# EAGLE schematic NoiseSampleHold (EAGLE 9.6.2)
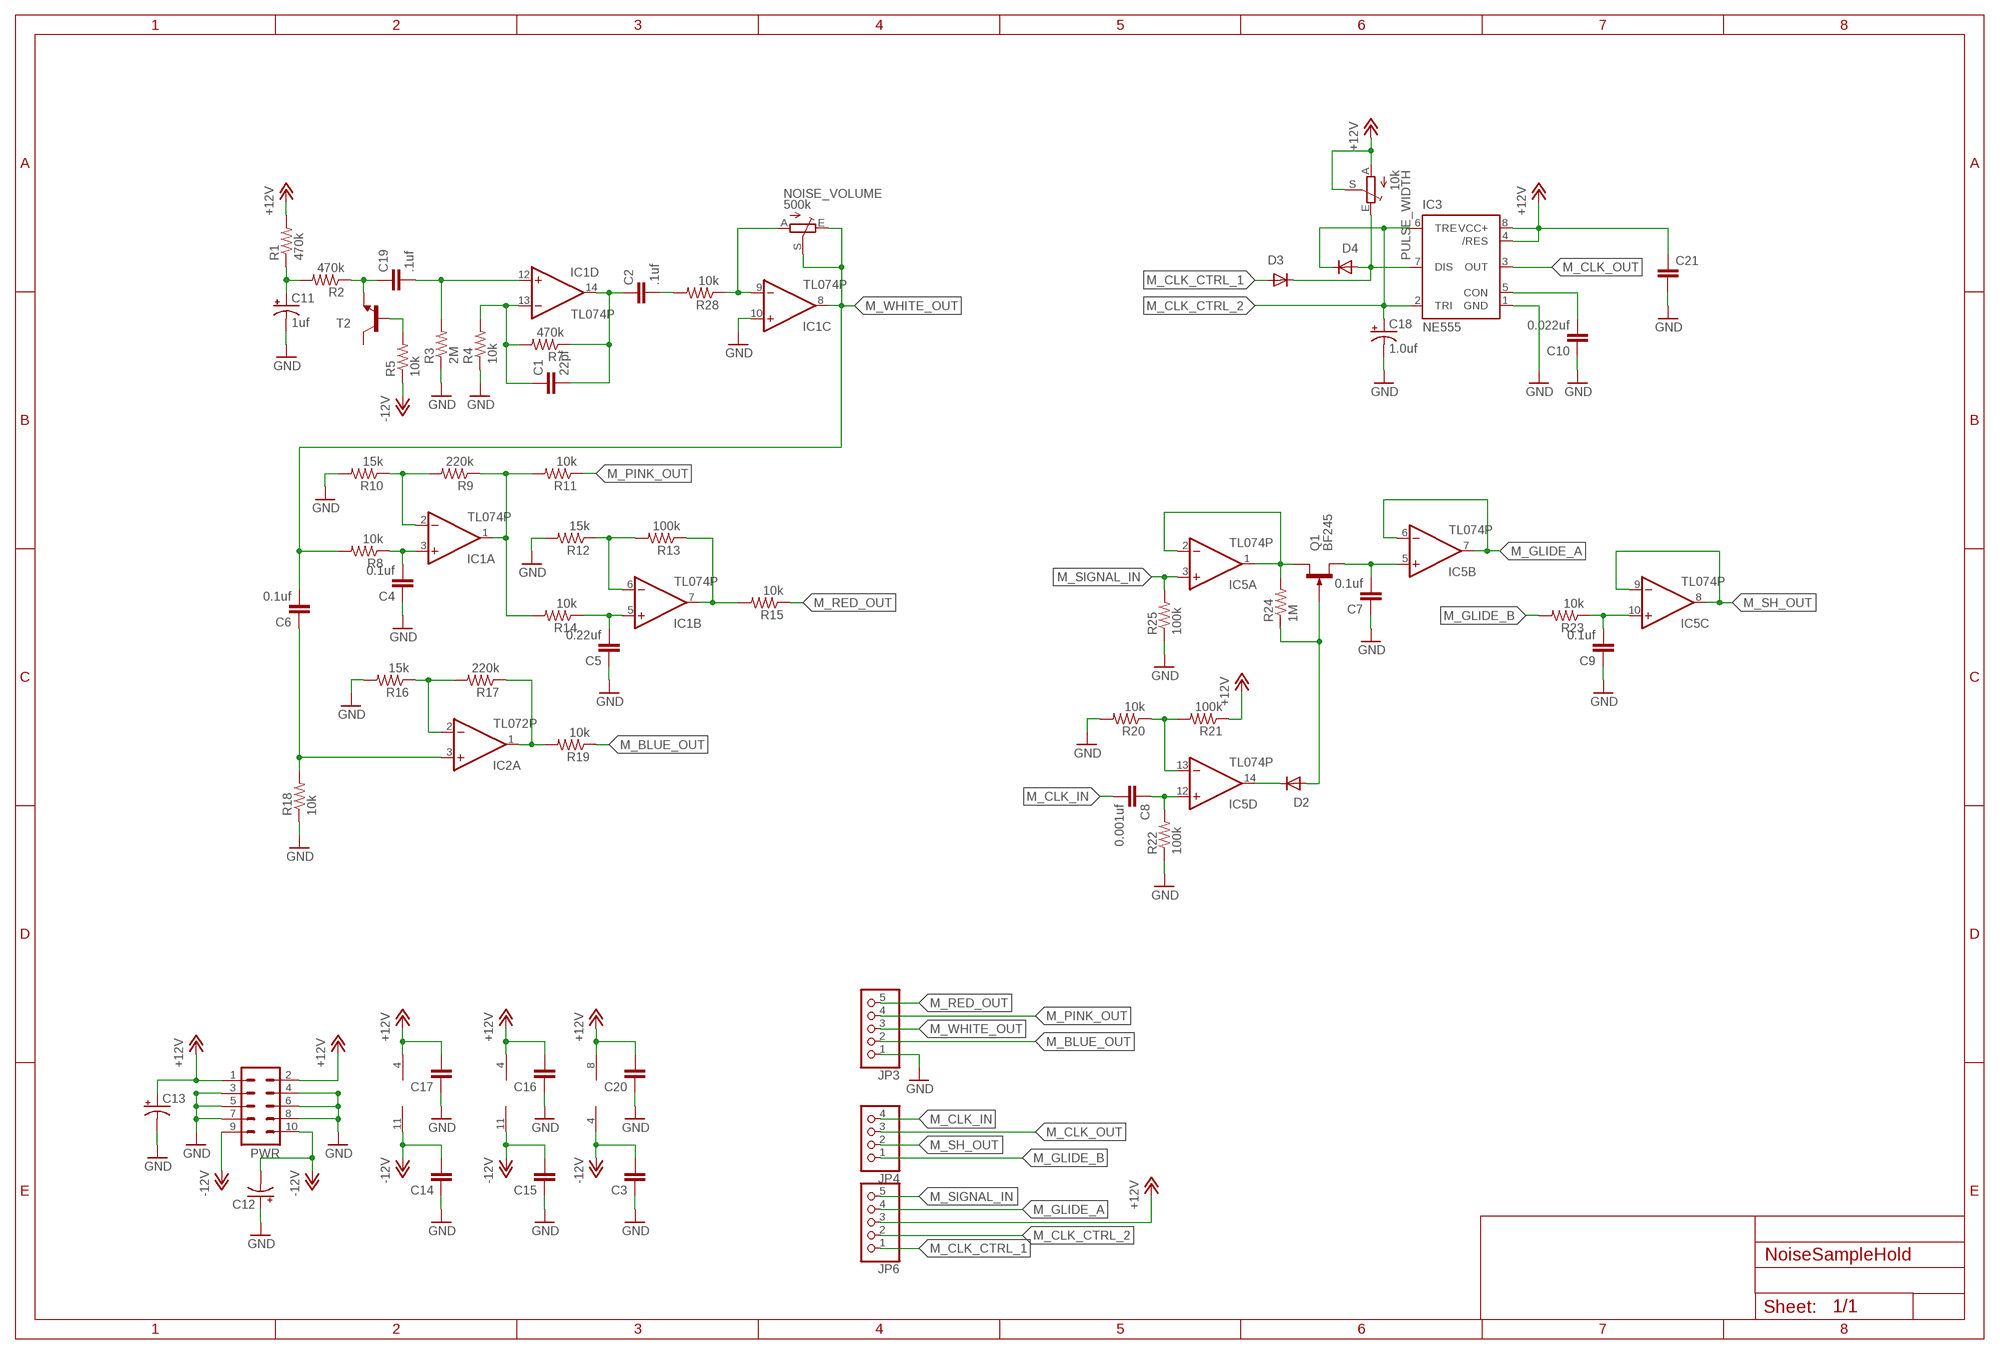
[diagram p0: schematic, sheet 1]

## Parts
C1  22pf  C-EU050-024X044  [C050-024X044]
C2  .1uf  C-EU050-024X044  [C050-024X044]
C3  C-EU050-024X044  [C050-024X044]
C4  0.1uf  C-EU050-024X044  [C050-024X044]
C5  0.22uf  C-EU050-024X044  [C050-024X044]
C6  0.1uf  C-EU050-024X044  [C050-024X044]
C7  0.1uf  C-EU050-024X044  [C050-024X044]
C8  0.001uf  C-EU050-024X044  [C050-024X044]
C9  0.1uf  C-EU050-024X044  [C050-024X044]
C10  0.022uf  C-EU050-024X044  [C050-024X044]
C11  1uf  CPOL-USE2.5-5  [E2,5-5]
C12  CPOL-USE2.5-5  [E2,5-5]
C13  CPOL-USE2.5-5  [E2,5-5]
C14  C-EU050-024X044  [C050-024X044]
C15  C-EU050-024X044  [C050-024X044]
C16  C-EU050-024X044  [C050-024X044]
C17  C-EU050-024X044  [C050-024X044]
C18  1.0uf  CPOL-USE2.5-5  [E2,5-5]
C19  .1uf  C-EU050-024X044  [C050-024X044]
C20  C-EU050-024X044  [C050-024X044]
C21  C-EU050-024X044  [C050-024X044]
D2  1N4148DO35-7  [DO35-7]
D3  1N4148DO35-7  [DO35-7]
D4  1N4148DO35-7  [DO35-7]
IC1  TL074P  [DIL14]
IC2  TL072P  [DIL08]
IC3  NE555  [DIL-08]
IC5  TL074P  [DIL14]
JP3  PINHD-1X5  [1X05]
JP4  PINHD-1X4  [1X04]
JP6  PINHD-1X5  [1X05]
NOISE_VOLUME  500k  TRIM_1234-S64YW  [S64YW]
PULSE_WIDTH  10k  TRIM_1234-S64YW  [S64YW]
PWR  ML10  [ML10]
Q1  BF245  [SOT54C]
R1  470k  R-US_0204/7  [0204/7]
R2  470k  R-US_0204/7  [0204/7]
R3  2M  R-US_0204/7  [0204/7]
R4  10k  R-US_0204/7  [0204/7]
R5  10k  R-US_0204/7  [0204/7]
R7  470k  R-US_0204/7  [0204/7]
R8  10k  R-US_0204/7  [0204/7]
R9  220k  R-US_0204/7  [0204/7]
R10  15k  R-US_0204/7  [0204/7]
R11  10k  R-US_0204/7  [0204/7]
R12  15k  R-US_0204/7  [0204/7]
R13  100k  R-US_0204/7  [0204/7]
R14  10k  R-US_0204/7  [0204/7]
R15  10k  R-US_0204/7  [0204/7]
R16  15k  R-US_0204/7  [0204/7]
R17  220k  R-US_0204/7  [0204/7]
R18  10k  R-US_0204/7  [0204/7]
R19  10k  R-US_0204/7  [0204/7]
R20  10k  R-US_0204/7  [0204/7]
R21  100k  R-US_0204/7  [0204/7]
R22  100k  R-US_0204/7  [0204/7]
R23  10k  R-US_0204/7  [0204/7]
R24  1M  R-US_0204/7  [0204/7]
R25  100k  R-US_0204/7  [0204/7]
R28  10k  R-US_0204/7  [0204/7]
T2  2N3904-NPN-TO92-EBC  [TO92-EBC]

## Nets
+12V: C13.+ C16.2 C17.2 C20.2 C21.1 IC1.4(P:V+) IC2.8(P:V+) IC3.4(/RES) IC3.8(VCC+) IC5.4(P:V+) JP6.3 PULSE_WIDTH.A PULSE_WIDTH.S PWR.1 PWR.2 R1.2 R21.1
-12V: C3.2 C12.- C14.2 C15.2 IC1.11(P:V-) IC2.4(P:V-) IC5.11(P:V-) PWR.9 PWR.10 R5.1
GND: C3.1 C4.1 C5.1 C7.1 C9.1 C10.1 C11.- C12.+ C13.- C14.1 C15.1 C16.1 C17.1 C18.- C20.1 C21.2 IC1.10(C:+IN) IC3.1(GND) JP3.1 PWR.3 PWR.4 PWR.5 PWR.6 PWR.7 PWR.8 R3.1 R4.1 R10.2 R12.2 R16.2 R18.1 R20.2 R22.1 R25.1
M_BLUE_OUT: JP3.2 R19.1
M_CLK_CTRL_1: D3.A JP6.1
M_CLK_CTRL_2: C18.+ D4.C IC3.2(TRI) IC3.6(TRE) JP6.2
M_CLK_IN: C8.2 JP4.4
M_CLK_OUT: IC3.3(OUT) JP4.3
M_GLIDE_A: IC5.6(B:-IN) IC5.7(B:OUT) JP6.4
M_GLIDE_B: JP4.1 R23.2
M_PINK_OUT: JP3.4 R11.1
M_RED_OUT: JP3.5 R15.1
M_SH_OUT: IC5.8(C:OUT) IC5.9(C:-IN) JP4.2
M_SIGNAL_IN: IC5.3(A:+IN) JP6.5 R25.2
M_WHITE_OUT: C6.2 IC1.8(C:OUT) JP3.3 NOISE_VOLUME.E NOISE_VOLUME.S R8.2
N$1: C19.1 R2.1 T2.E
N$2: C11.+ R1.1 R2.2
N$3: R5.2 T2.B
N$4: C19.2 IC1.12(D:+IN) R3.2
N$5: C1.1 IC1.13(D:-IN) R4.2 R7.2
N$6: C1.2 C2.1 IC1.14(D:OUT) R7.1
N$7: C2.2 R28.2
N$10: C4.2 IC1.3(A:+IN) R8.1
N$11: IC1.2(A:-IN) R9.2 R10.1
N$12: IC1.1(A:OUT) R9.1 R11.2 R14.2
N$13: IC5.1(A:OUT) IC5.2(A:-IN) Q1.D R24.2
N$16: IC1.6(B:-IN) R12.1 R13.2
N$17: IC1.7(B:OUT) R13.1 R15.2
N$18: C5.2 IC1.5(B:+IN) R14.1
N$19: D3.C D4.A IC3.7(DIS) PULSE_WIDTH.E
N$20: C6.1 IC2.3(A:+IN) R18.2
N$21: IC2.2(A:-IN) R16.1 R17.2
N$22: IC2.1(A:OUT) R17.1 R19.2
N$23: C10.2 IC3.5(CON)
N$24: IC5.13(D:-IN) R20.1 R21.2
N$25: C8.1 IC5.12(D:+IN) R22.2
N$26: IC1.9(C:-IN) NOISE_VOLUME.A R28.1
N$29: D2.C IC5.14(D:OUT)
N$30: D2.A Q1.G R24.1
N$31: C7.2 IC5.5(B:+IN) Q1.S
N$33: C9.2 IC5.10(C:+IN) R23.1
Unconnected: IC2.5(B:+IN) IC2.6(B:-IN) IC2.7(B:OUT) NOISE_VOLUME.S@1(S) PULSE_WIDTH.S@1(S) T2.C

## Library data of the parts
C1-C10 C14-C17 C19-C21 = resistor:C-EU: CAPACITOR, European symbol
C11-C13 C18 = resistor:CPOL-US: POLARIZED CAPACITOR, American symbol
D2-D4 = diode:1N4148: DIODE high speed (Philips)
IC1 IC5 = linear:TL074: OP AMP
IC2 = TomW:TL072: OP AMP
IC3 = st-microelectronics:NE555: General purpose bipolar Timer; MF: Arrow Electronics; MPN: NE555N; OC_FARNELL: 1467742; OC_NEWARK: 89K1486
JP3 JP6 = pinhead:PINHD-1X5: PIN HEADER
JP4 = pinhead:PINHD-1X4: PIN HEADER
NOISE_VOLUME PULSE_WIDTH = pot:TRIM_1234-: POTENTIOMETER
PWR = con-ml:ML10: HARTING; OC_FARNELL: unknown; OC_NEWARK: unknown
Q1 = transistor-small-signal:BF245: N-CHANNEL FET http://www.onsemi.com/pub/Collateral/BF245A-D.PDF
R1-R5 R7-R25 R28 = resistor:R-US_: RESISTOR, American symbol
T2 = transistor-neu-to92:*-NPN-: NPN Transistror